# Altium schematic sheet 07_FE_SWITCHING.SchDoc
size A4; SheetNumber: 8; SheetTotal: 11
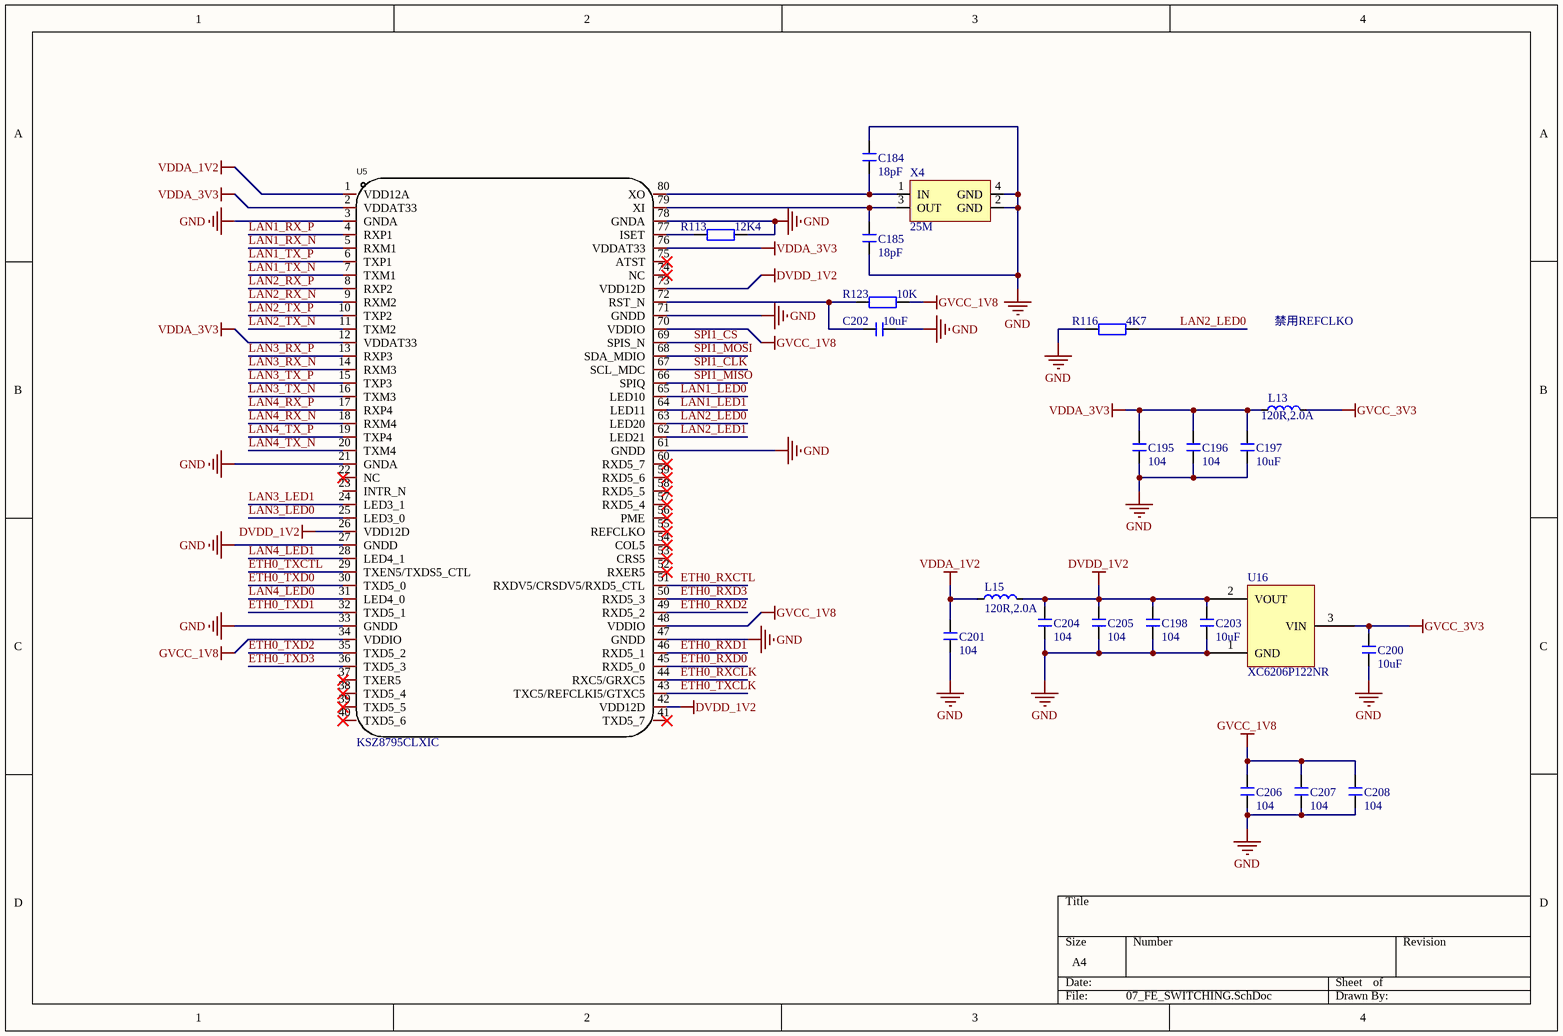
[diagram p0: 07_FE_SWITCHING.SchDoc]

## Parts
C184  18pF  [C 0603]
C185  18pF  [C 0603]
C195  104  [C 0603]
C196  104  [C 0603]
C197  10uF  [C 0603]
C198  104  [C 0603]
C200  10uF  [C 0603]
C201  104  [C 0603]
C202  10uF  [C 0603]
C203  10uF  [C 0603]
C204  104  [C 0603]
C205  104  [C 0603]
C206  104  [C 0603]
C207  104  [C 0603]
C208  104  [C 0603]
L13  120R,2.0A  [L 0603]
L15  120R,2.0A  [L 0603]
R113  12K4  [R 0603]
R116  4K7  [R 0603]
R123  10K  [R 0603]
U5  KSZ8795CLXIC  [LQFP80_10x10]
U16  XC6206P122NR  [SOT23-3M]
X4  25M  [XTAL-3225]

## Nets
DVDD_1V2: C198.2 C203.2 C204.2 C205.2 L15.2 U5.26(VDD12D) U5.42(VDD12D) U5.73(VDD12D) U16.2(VOUT)
GND: C184.2 C185.1 C195.1 C196.1 C197.1 C198.1 C200.1 C201.1 C202.1 C203.1 C204.1 C205.1 C206.1 C207.1 C208.1 R113.2 R116.1 U5.3(GNDA) U5.21(GNDA) U5.27(GNDD) U5.33(GNDD) U5.47(GNDD) U5.61(GNDD) U5.71(GNDD) U5.78(GNDA) U16.1(GND) X4.2(GND) X4.4(GND)
GVCC_1V8: C206.2 C207.2 C208.2 R123.2 U5.34(VDDIO) U5.48(VDDIO) U5.70(VDDIO)
GVCC_3V3: C200.2 L13.2 U16.3(VIN)
VDDA_1V2: C201.2 L15.1 U5.1(VDD12A)
VDDA_3V3: C195.2 C196.2 C197.2 L13.1 U5.2(VDDAT33) U5.12(VDDAT33) U5.76(VDDAT33)
ETH0_RXCLK: U5.44(RXC5/GRXC5)
ETH0_RXCTL: U5.51(RXDV5/CRSDV5/RXD5_CTL)
ETH0_RXD0: U5.45(RXD5_0)
ETH0_RXD1: U5.46(RXD5_1)
ETH0_RXD2: U5.49(RXD5_2)
ETH0_RXD3: U5.50(RXD5_3)
ETH0_TXCLK: U5.43(TXC5/REFCLKI5/GTXC5)
ETH0_TXCTL: U5.29(TXEN5/TXDS5_CTL)
ETH0_TXD0: U5.30(TXD5_0)
ETH0_TXD1: U5.32(TXD5_1)
ETH0_TXD2: U5.35(TXD5_2)
ETH0_TXD3: U5.36(TXD5_3)
LAN1_LED0: U5.65(LED10)
LAN1_LED1: U5.64(LED11)
LAN1_RX_N: U5.5(RXM1)
LAN1_RX_P: U5.4(RXP1)
LAN1_TX_N: U5.7(TXM1)
LAN1_TX_P: U5.6(TXP1)
LAN2_LED0: R116.2 U5.63(LED20)
LAN2_LED1: U5.62(LED21)
LAN2_RX_N: U5.9(RXM2)
LAN2_RX_P: U5.8(RXP2)
LAN2_TX_N: U5.11(TXM2)
LAN2_TX_P: U5.10(TXP2)
LAN3_LED0: U5.25(LED3_0)
LAN3_LED1: U5.24(LED3_1)
LAN3_RX_N: U5.14(RXM3)
LAN3_RX_P: U5.13(RXP3)
LAN3_TX_N: U5.16(TXM3)
LAN3_TX_P: U5.15(TXP3)
LAN4_LED0: U5.31(LED4_0)
LAN4_LED1: U5.28(LED4_1)
LAN4_RX_N: U5.18(RXM4)
LAN4_RX_P: U5.17(RXP4)
LAN4_TX_N: U5.20(TXM4)
LAN4_TX_P: U5.19(TXP4)
SPI1_CLK: U5.67(SCL_MDC)
SPI1_CS: U5.69(SPIS_N)
SPI1_MISO: U5.66(SPIQ)
SPI1_MOSI: U5.68(SDA_MDIO)
NetC184_1: C184.1 U5.80(XO) X4.1(IN)
NetC185_2: C185.2 U5.79(XI) X4.3(OUT)
NetC202_2: C202.2 R123.1 U5.72(RST_N)
NetR113_1: R113.1 U5.77(ISET)

Not connected (* = marked no-connect by the designer): U5 22(NC)* 23(INTR_N) 37(TXER5)* 38(TXD5_4)* 39(TXD5_5)* 40(TXD5_6)* 41(TXD5_7)* 52(RXER5)* 53(CRS5)* 54(COL5)* 55(REFCLKO)* 56(PME)* 57(RXD5_4)* 58(RXD5_5)* 59(RXD5_6)* 60(RXD5_7)* 74(NC)* 75(ATST)*

## Notes on the sheet
- 禁用REFCLKO

## Library data of the parts
C184 C185 C195-C198 C200-C208 = C: 无极性贴片电容; 版权归属: 源创客; BOM名称: 无极性贴片电容; 学习资源: www.ooocke.com
L13 L15 = L: 小功率贴片电感磁珠; 版权归属: 源创客; BOM名称: 小功率贴片电感; 学习资源: www.ooocke.com
R113 R116 R123 = R: 贴片电阻; 版权归属: 源创客; BOM名称: 贴片电阻; 学习资源: www.ooocke.com
U5 = KSZ8795CLXIC: Manufacturer: MICROCHIP(美国微芯); Add into BOM: yes; Application Function: 交换机; Number of Channels: 5; Interface: MII；RMII; Supply Voltage: 3.3V; Name: KSZ8795CLXIC; Symbol: KSZ8795CLXIC; Device: KSZ8795CLXIC; LCSC Part Name: KSZ8795CLXIC; Supplier Part: C69416; Manufacturer Part: KSZ8795CLXIC; Supplier Footprint: LQFP-80(10x10); JLCPCB Part Class: Extended Part; Datasheet: https://atta.szlcsc.com/upload/public/pdf/source/20160723/1469258974576.pdf; Supplier: LCSC; Convert to PCB: yes; Operating Temperature: -40℃~+85℃
U16 = XC6206-1.8NR
X4 = XTAL-4P: 4脚无源晶振; BOM名称: 4脚晶振; 版权归属: 源创客; 学习资源: www.ooocke.com